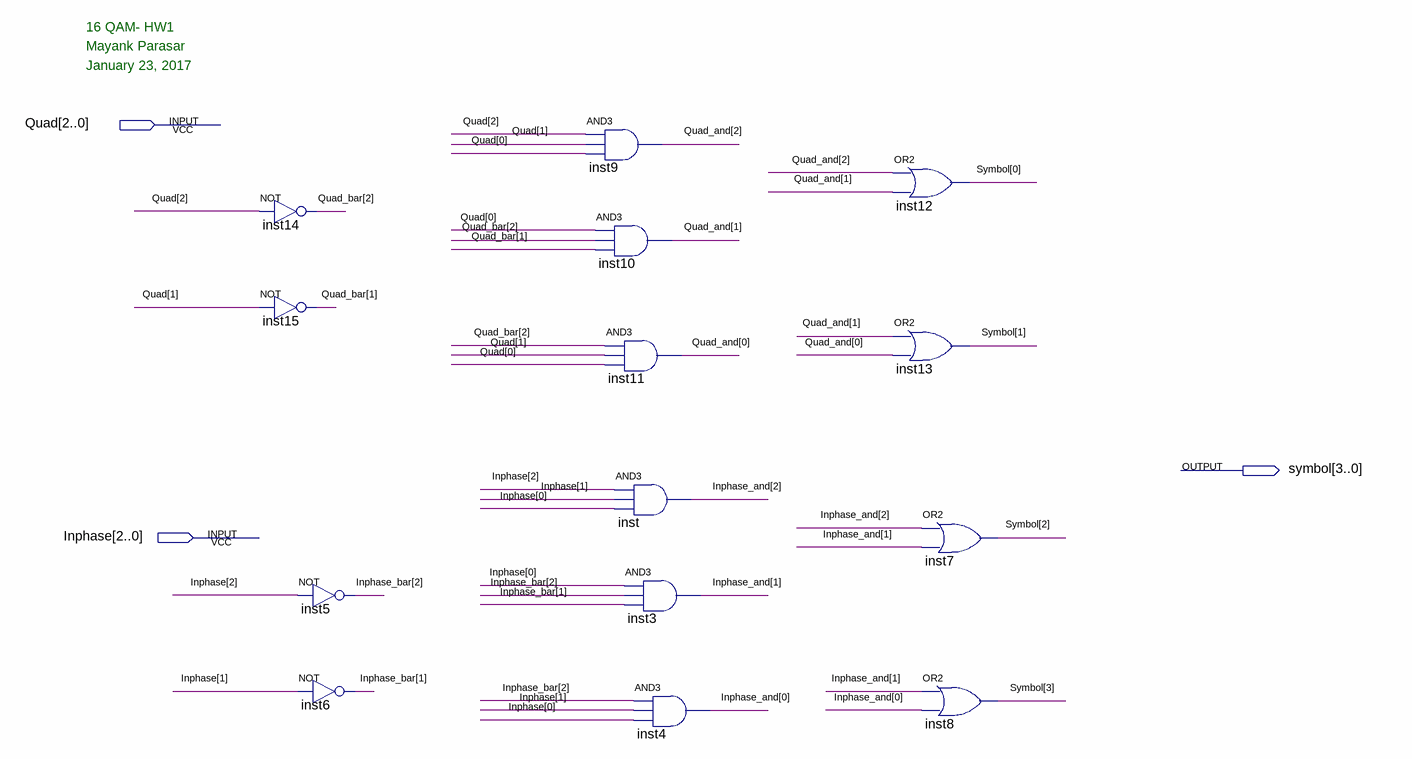
[diagram p0: schematic sheet]
// Quartus schematic HW1_part_C.bdf as structural Verilog: 14 symbols, 3 pins
module HW1_part_C (
  input  [2:0] Quad,
  input  [2:0] Inphase,
  output [3:0] symbol
);

  wire [2:0] Inphase_and, Quad_and;
  wire [2:1] Inphase_bar, Quad_bar;

  not inst14 (Quad_bar[2], Quad[2]);
  not inst15 (Quad_bar[1], Quad[1]);
  not inst5 (Inphase_bar[2], Inphase[2]);
  not inst6 (Inphase_bar[1], Inphase[1]);
  and inst9 (Quad_and[2], Quad[2], Quad[1], Quad[0]);
  and inst10 (Quad_and[1], Quad[0], Quad_bar[2], Quad_bar[1]);
  and inst11 (Quad_and[0], Quad_bar[2], Quad[1], Quad[0]);
  and inst (Inphase_and[2], Inphase[2], Inphase[1], Inphase[0]);
  and inst3 (Inphase_and[1], Inphase[0], Inphase_bar[2], Inphase_bar[1]);
  and inst4 (Inphase_and[0], Inphase_bar[2], Inphase[1], Inphase[0]);
  or inst12 (symbol[0], Quad_and[2], Quad_and[1]);
  or inst13 (symbol[1], Quad_and[1], Quad_and[0]);
  or inst7 (symbol[2], Inphase_and[2], Inphase_and[1]);
  or inst8 (symbol[3], Inphase_and[1], Inphase_and[0]);

  // Notes on the sheet:
  //   16 QAM- HW1
  //   Mayank Parasar
  //   January 23, 2017
endmodule
